# Altium schematic sheet GPS.SchDoc
size A4; SheetNumber: 1; SheetTotal: 2
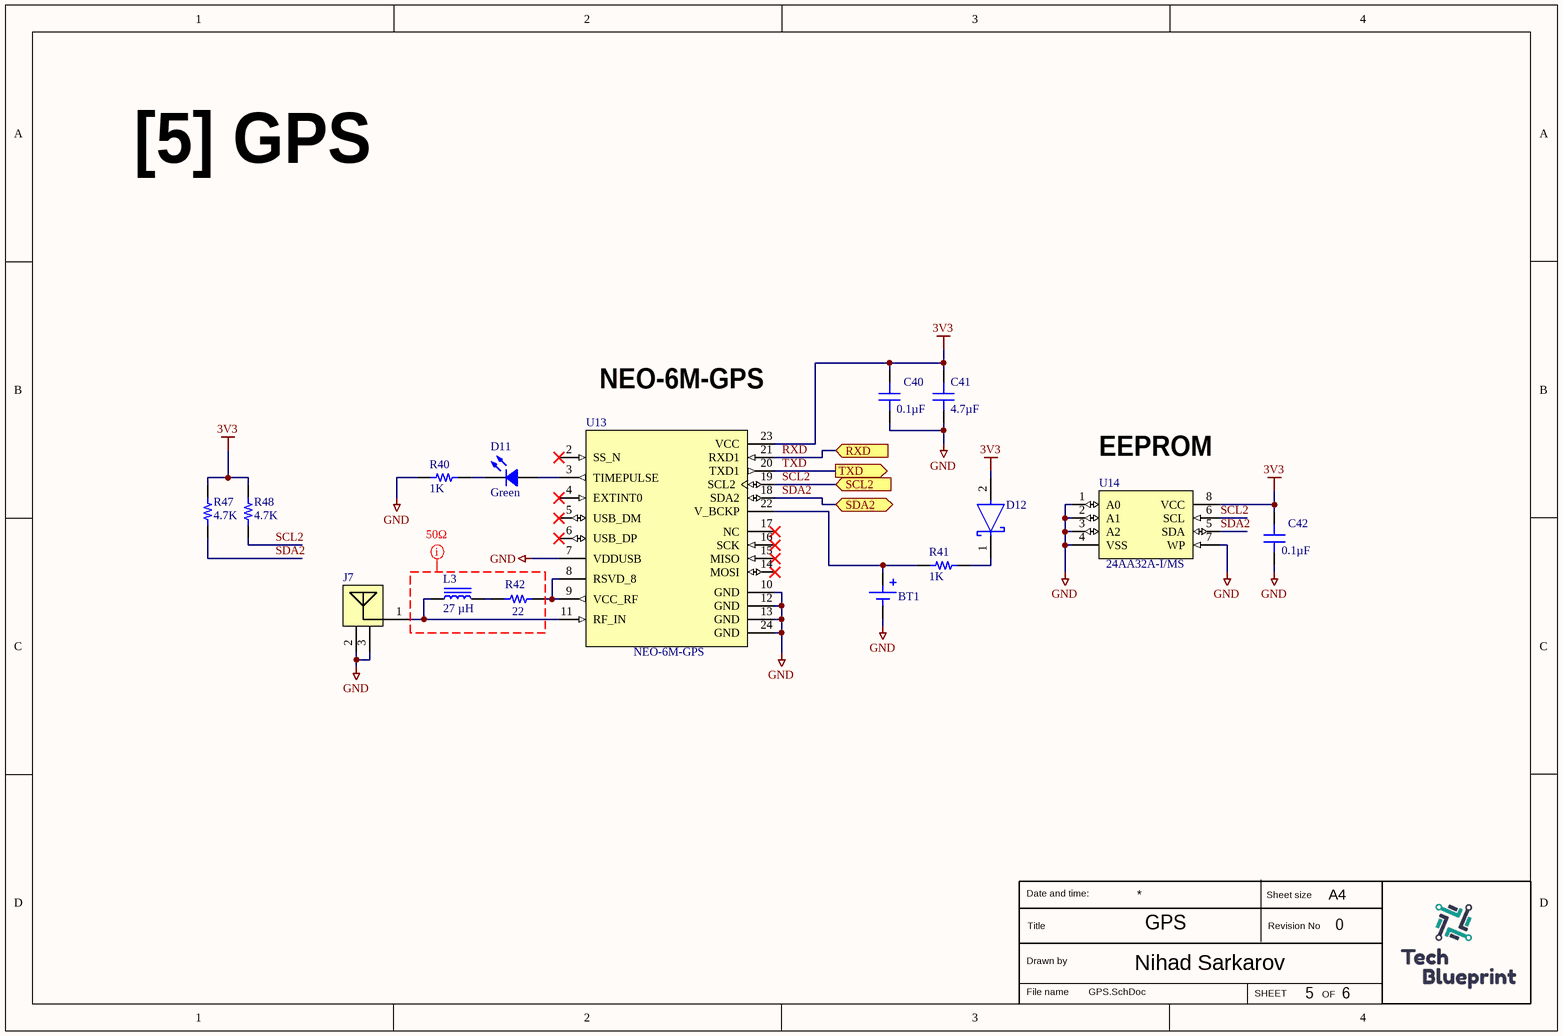
[diagram p0: GPS.SchDoc]

## Parts
BT1  MS621FE-FL11E  [BAT_MS621FE-FL11E]  (value not drawn)
C40  0.1µF  [CAP 0805_2012]
C41  4.7µF  [CAP 0805_2012]
C42  0.1µF  [CAP 0805_2012]
D11  Green  [LED 0603_1608 GREEN]
D12  B0530WS-7-F  [FP-SOD323-MFG]  (value not drawn)
J7  U.FL-R-SMT-1(10)  [FP-U_FL-R-SMT-1_10-MFG]  (value not drawn)
L3  27 µH  [TDK MLF1608]
R40  1K  [RES 0603_1608]
R41  1K  [RES 0805_2012]
R42  22  [RES 0603_1608]
R47  4.7K  [KOA RES RK73 RN73 0603_1608]
R48  4.7K  [KOA RES RK73 RN73 0603_1608]
U13  NEO-6M-GPS  [XCVR_NEO-6M-GPS]
U14  24AA32A-I/MS  [SOP65P490X110-8N]

## Ports
RXD (in, see MCU[7B]), SCL2 (in, see MCU[6B], Sensors[2D]), SDA2 (bidir, see MCU[6B], Sensors[2D]), TXD (out, see MCU[7B])

## Nets
3V3: C40.2 C41.2 C42.2 D12.2(A) R47.2 R48.2 U13.23(VCC) U14.8(VCC)
GND: BT1.NEG C40.1 C41.1 C42.1 J7.2(GND) J7.3(GND) R40.1 U13.7(VDDUSB) U13.10(GND) U13.12(GND) U13.13(GND) U13.24(GND) U14.1(A0) U14.2(A1) U14.3(A2) U14.4(VSS) U14.7(WP)
RXD: U13.21(RXD1) ; port RXD
SCL2: R48.1 U13.19(SCL2) U14.6(SCL) ; port SCL2
SDA2: R47.1 U13.18(SDA2) U14.5(SDA) ; port SDA2
TXD: U13.20(TXD1) ; port TXD
NetBT1_POS: BT1.POS R41.1 U13.22(V_BCKP)
NetD11_1: D11.1 U13.3(TIMEPULSE)
NetD11_2: D11.2 R40.2
NetD12_1: D12.1(C) R41.2
NetJ7_1: J7.1(SIG) L3.1 U13.11(RF_IN)
NetL3_2: L3.2 R42.1
NetR42_2: R42.2 U13.8(RSVD_8) U13.9(VCC_RF)

Not connected (* = marked no-connect by the designer): U13 2(SS_N)* 4(EXTINT0)* 5(USB_DM)* 6(USB_DP)* 14(MOSI)* 15(MISO)* 16(SCK)* 17(NC)*

## Layout directives
net class RF_50Ω: (no net found under the mark)

## Notes on the sheet
- [5] GPS
- (near U13) NEO-6M-GPS
- (near U14) EEPROM
- GPS
- 0
- 5
- 6
- Date and time:
- Title
- Sheet size
- Revision No
- A4
- Drawn by
- File name
- Nihad Sarkarov
- SHEET
- OF

## Library data of the parts
BT1 = MS621FE-FL11E: MF: {'manufacturer': u'Seiko Instruments'}; Package: None; Price: None; Value: *; MP: MS621FE-FL11E; Availability: Unavailable
C40 C42 = 08053C104KAT4A: CAP CER 0.1UF 25V X7R 0805; manufacturer: AVX Corporation; Tolerance: ±10%; Part Number: 08053C104KAT4A; Capacitance: 0.1µF; Applications: General Purpose; componentlink1description: Datasheet; componentlink1url: http://datasheets.avx.com/X7RDielectric.pdf; componentlink2description: DigiKey Link; componentlink2url: http://digikey.com/product-detail/en/avx-corporation/08053C104KAT4A/478-13052-1-ND/9948570; Device Package: 0805 (2012 Metric); lastupdated: 9/2/2020 1:04:37 AM; Lifecycle Status: Active; Minimum Order: 1; Mounting Type: Surface Mount, MLCC; Operating Temperature: -55°C ~ 125°C; Package / Case: 0805 (2012 Metric); packaging: TapeAndReel; partid: 5333; Part Status: Active; price: 0.02; series: -; Size / Dimension: 0.079" L x 0.049" W (2.01mm x 1.25mm); Supplier 1: DigiKey; Supplier Part Number 1: 478-13052-1-ND; Temperature Coefficient: X7R; Thickness (Max): 0.037" (0.94mm); value: 0.1µF; Voltage - Rated: 25V
C41 = 0805ZD475KAT2A: CAP CER 4.7UF 10V X5R 0805; manufacturer: AVX Corporation; Tolerance: ±10%; Part Number: 0805ZD475KAT2A; Capacitance: 4.7µF; Applications: General Purpose; componentlink1description: Datasheet; componentlink1url: http://datasheets.avx.com/cx5r.pdf; componentlink2description: DigiKey Link; componentlink2url: http://digikey.com/product-detail/en/avx-corporation/0805ZD475KAT2A/478-1415-1-ND/564447; Device Package: 0805 (2012 Metric); lastupdated: 9/2/2020 1:04:40 AM; Lifecycle Status: Active; Minimum Order: 1; Mounting Type: Surface Mount, MLCC; Operating Temperature: -55°C ~ 85°C; Package / Case: 0805 (2012 Metric); packaging: TapeAndReel; partid: 3139; Part Status: Active; price: 0.12; series: -; Size / Dimension: 0.079" L x 0.049" W (2.01mm x 1.25mm); Supplier 1: DigiKey; Supplier Part Number 1: 478-1415-1-ND; Temperature Coefficient: X5R; Thickness (Max): 0.055" (1.40mm); value: 4.7µF; Voltage - Rated: 10V
D11 = LSM0603453V: LED GREEN CLEAR CHIP 0603 SMD; Manufacturer: Visual Communications Company - VCC; Configuration: Standard; Current - Test: 20mA; Lens Color: Colorless; Lens Size: 1.20mm x 0.80mm; Lens Style: Rectangle with Flat Top; Millicandela Rating: 63mcd; Viewing Angle: 120°; Voltage - Forward (Vf) (Typ): 2V; Wavelength - Dominant: 572nm; Wavelength - Peak: 571nm; Part Number: LSM0603453V; Color: Green; ComponentLink1Description: Datasheet; ComponentLink1URL: https://vcclite.com/wp-content/uploads/wpallimport/files/files/LSM0603453V.pdf; ComponentLink2Description: DigiKey Link; ComponentLink2URL: https://www.digikey.com/en/products/detail/visual-communications-company-vcc/LSM0603453V/9486724; Device Package: 0603 (1608 Metric); Height (Max): 0.65mm; LastUpdated: 6/3/2024 7:58:54 PM; Lens Transparency: Clear; Lifecycle Status: Active; Minimum Order: 1; Mounting Type: Surface Mount; Package / Case: 0603 (1608 Metric); Packaging: TapeAndReel; PartId: 579; Part Status: Active; Price: 0.09; Series: LSM0603; Size / Dimension: 1.60mm L x 0.80mm W; Supplier 1: DigiKey; Supplier Part Number 1: LSM0603453VCT-ND; Supplier Device Package: Chip LED; Value: Green
D12 = CMP-12790-000023-1: DIODE SCHOTTKY 30V 500MA SOD323; Manufacturer: Diodes Inc.; Max Surge Forward Current: 2A; Forward Current: 0.5A; Automotive Grade: Grade 1; Max Junction Temp: +125°C; Standoff Height: 0.05mm; Peak Reverse Current: 500uA; Value: 58pF; Temperature Range Low: -40°C; Max Repetitive Reverse Voltage: 30V; Lead Free: Yes; Device Class L1: Discrete Semiconductors; RoHS: TRUE; Octopart: https://octopart.com/b0530ws-7-f-diodes+inc.-325723; Height: 1.2mm; Digikey Description: DIODE SCHOTTKY 30V 500MA SOD323; ComponentLink2URL: https://www.diodes.com/assets/Datasheets/ds30249.pdf; Device Class L2: Diodes; Reverse Voltage: 30V; Ipc Land Pattern Name: SOD250130X120-2; Footprint Url: https://www.diodes.com/assets/Package-Files/SOD323.pdf; Device Class L3: Schottky Diodes; Package: SOD323; ComponentLink2Description: Datasheet; Automotive: Yes; Temperature Range High: +125°C; Manufacturer Part Number: B0530WS-7-F; Category: Diode; Temperature: -40°C to +125°C; Mouser Description: Schottky Diodes & Rectifiers SCHOTTKY RECTIFIER; Capacitance: 58pF
J7 = CMP-2000-05152-3: CONN U.FL RCPT STR 50 OHM SMD; Max Frequency: 6GHz; Connector Type: Coaxial; Body Plating: Silver; Body Material: Bronze; Impedance: 50R; Dielectric Material: Polymer; Insulation Resistance: 500MR; Gender: Male; Packaging: Cut Tape; Length: 3mm; Package Quantity: 2500; Termination: Solder; Lead Free: Lead Free; Series: U.FL; Min Operating Temperature: -40°C; Fastening Type: Snap; Contact Material: Brass; Orientation: Straight; Wire/Cable Type: Coaxial; Frequency: 6GHz; Contact Plating: Gold; Depth: 3.1mm; Weight: 0.001764oz; Max Operating Temperature: 90°C; Radiation Hardening: No; REACH SVHC: No SVHC; Mount: Surface Mount; Housing Color: Beige
L3 = MLF1608C270KTD00: FIXED IND 27UH 2MA 1.8 OHM SMD; Manufacturer: TDK Corporation; DC Resistance (DCR): 1.8Ohm Max; Frequency - Self Resonant: 15MHz; Inductance Frequency - Test: 1 MHz; Material - Core: Ferrite; Q @ Freq: 20 @ 1MHz; Shielding: Shielded; Tolerance: ±10%; Type: Multilayer; Part Number: MLF1608C270KTD00; ComponentLink1Description: Datasheet; ComponentLink1URL: https://product.tdk.com/info/en/catalog/datasheets/inductor_commercial_standard_mlf1608_en.pdf?ref_disty=digikey; ComponentLink2Description: DigiKey Link; ComponentLink2URL: https://www.digikey.com/en/products/detail/tdk-corporation/MLF1608C270KTD00/504199; Current Rating (Amps): 2 mA; Device Package: 0603 (1608 Metric); Height - Seated (Max): 0.037" (0.95mm); Inductance: 27 µH; LastUpdated: 7/26/2024 2:55:23 PM; Lifecycle Status: Active; Minimum Order: 1; Mounting Type: Surface Mount; Operating Temperature: -40°C ~ 85°C; Package / Case: 0603 (1608 Metric); Packaging: TapeAndReel; PartId: 8154; Part Status: Active; Price: 0.04; Series: MLF; Size / Dimension: 0.063" L x 0.031" W (1.60mm x 0.80mm); Supplier 1: DigiKey; Supplier Part Number 1: 445-1030-1-ND; Supplier Device Package: 0603 (1608 Metric); Value: 27 µH
R40 = RMCF0603JT1K00: RES 1K OHM 5% 1/10W 0603; Manufacturer: Stackpole Electronics Inc; Power (Watts): 0.1W, 1/10W; Resistance: 1 kOhms; Temperature Coefficient: ±200ppm/°C; Part Number: RMCF0603JT1K00; Value: 1K; ComponentLink1Description: Datasheet; ComponentLink1URL: https://www.seielect.com/catalog/sei-rmcf_rmcp.pdf; ComponentLink2Description: DigiKey Link; ComponentLink2URL: https://www.digikey.com/en/products/detail/stackpole-electronics-inc/RMCF0603JT1K00/1758057; Composition: Thick Film; Device Package: 0603 (1608 Metric); Features: Automotive AEC-Q200; Height - Seated (Max): 0.022" (0.55mm); LastUpdated: 2/9/2024 8:43:33 PM; Lifecycle Status: Active; Minimum Order: 1; Number of Terminations: 2; Operating Temperature: -55°C ~ 155°C; Package / Case: 0603 (1608 Metric); Packaging: CutTape; PartId: 5824; Part Status: Active; Price: 0.01; Ratings: AEC-Q200; Series: RMCF; Size / Dimension: 0.061" L x 0.031" W (1.55mm x 0.80mm); Supplier 1: DigiKey; Supplier Part Number 1: RMCF0603JT1K00CT-ND; Supplier Device Package: 0603; Tolerance: ±5%
R41 = CRGH0805J1K0: RES SMD 1K OHM 5% 1/3W 0805; Manufacturer: TE Connectivity Passive Product; Power (Watts): 0.333W, 1/3W; Resistance: 1 kOhms; Temperature Coefficient: ±100ppm/°C; Part Number: CRGH0805J1K0; Value: 1K; ComponentLink1Description: Datasheet; ComponentLink1URL: https://www.te.com/commerce/DocumentDelivery/DDEController?Action=srchrtrv&DocNm=1773204-1&DocType=DS&DocLang=English; ComponentLink2Description: DigiKey Link; ComponentLink2URL: https://www.digikey.com/en/products/detail/te-connectivity-passive-product/CRGH0805J1K0/2385524; Composition: Thick Film; Device Package: 0805 (2012 Metric); LastUpdated: 2/8/2024 9:02:37 PM; Lifecycle Status: Active; Minimum Order: 1; Number of Terminations: 2; Operating Temperature: -55°C ~ 155°C; Package / Case: 0805 (2012 Metric); Packaging: TapeAndReel; PartId: 28125; Part Status: Active; Price: 0.01; Series: CRGH, Neohm; Size / Dimension: 0.083" L x 0.051" W (2.10mm x 1.30mm); Supplier 1: DigiKey; Supplier Part Number 1: A126435CT-ND; Supplier Device Package: 0805; Tolerance: ±5%
R42 = ERJ-3EKF22R0V: RES SMD 22 OHM 1% 1/10W 0603; Manufacturer: Panasonic Electronic Components; Power (Watts): 0.1W, 1/10W; Resistance: 22 Ohms; Temperature Coefficient: ±100ppm/°C; Part Number: ERJ-3EKF22R0V; Value: 22; ComponentLink1Description: Datasheet; ComponentLink1URL: https://industrial.panasonic.com/cdbs/www-data/pdf/RDA0000/AOA0000C304.pdf; ComponentLink2Description: DigiKey Link; ComponentLink2URL: https://www.digikey.com/en/products/detail/panasonic-electronic-components/ERJ-3EKF22R0V/1746340; Composition: Thick Film; Device Package: 0603 (1608 Metric); Features: Automotive AEC-Q200; Height - Seated (Max): 0.022" (0.55mm); LastUpdated: 2/9/2024 8:43:34 PM; Lifecycle Status: Active; Minimum Order: 1; Number of Terminations: 2; Operating Temperature: -55°C ~ 155°C; Package / Case: 0603 (1608 Metric); Packaging: TapeAndReel; PartId: 5655; Part Status: Active; Price: 0.01; Ratings: AEC-Q200; Series: ERJ-3EK; Size / Dimension: 0.063" L x 0.031" W (1.60mm x 0.80mm); Supplier 1: DigiKey; Supplier Part Number 1: P22.0HCT-ND; Supplier Device Package: 0603; Tolerance: ±1%
R47 R48 = RK73B1JTTD472J: RES 4.7K OHM 5% 1/10W 0603; Manufacturer: KOA Speer Electronics, Inc.; Power (Watts): 0.1W, 1/10W; Resistance: 4.7 kOhms; Temperature Coefficient: ±200ppm/°C; Part Number: RK73B1JTTD472J; Value: 4.7K; ComponentLink1Description: Datasheet; ComponentLink1URL: http://www.koaspeer.com/catimages/Products/RK73B/RK73B.pdf; ComponentLink2Description: DigiKey Link; ComponentLink2URL: https://www.digikey.com/en/products/detail/koa-speer-electronics-inc/RK73B1JTTD472J/9844699; Composition: Thick Film; Device Package: 0603 (1608 Metric); Features: Automotive AEC-Q200; Height - Seated (Max): 0.022" (0.55mm); LastUpdated: 7/25/2024 9:43:10 AM; Lifecycle Status: Active; Minimum Order: 1; Number of Terminations: 2; Operating Temperature: -55°C ~ 155°C; Package / Case: 0603 (1608 Metric); Packaging: CutTape; PartId: 5830; Part Status: Active; Price: 0.01; Ratings: AEC-Q200; Series: RK73B; Size / Dimension: 0.063" L x 0.031" W (1.60mm x 0.80mm); Supplier 1: DigiKey; Supplier Part Number 1: 2019-RK73B1JTTD472JCT-ND; Supplier Device Package: 0603; Tolerance: ±5%
U13 = NEO-6M-GPS: MF: {'manufacturer': u'u-blox'}; Package: None; Price: None; Value: *; MP: NEO-6M-GPS; Availability: Unavailable
U14 = 24AA32A-I/MS: MF: {'manufacturer': u'Microchip Technology'}; Package: None; Price: None; Value: *; MP: 24AA32A-I/MS; Availability: Unavailable